# Altium schematic sheet button.SchDoc
size A4
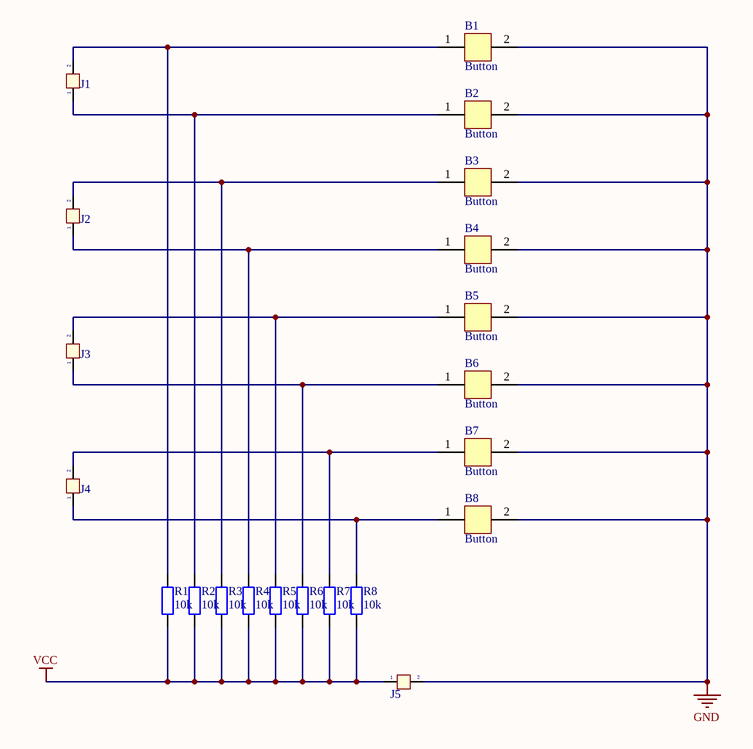
[diagram p0: button.SchDoc]

## Parts
B1  Button  [Button 2 Pin]
B2  Button  [Button 2 Pin]
B3  Button  [Button 2 Pin]
B4  Button  [Button 2 Pin]
B5  Button  [Button 2 Pin]
B6  Button  [Button 2 Pin]
B7  Button  [Button 2 Pin]
B8  Button  [Button 2 Pin]
J1  Jumper 2  [JP2]  (value not drawn)
J2  Jumper 2  [JP2]  (value not drawn)
J3  Jumper 2  [JP2]  (value not drawn)
J4  Jumper 2  [JP2]  (value not drawn)
J5  Jumper 2  [JP2]  (value not drawn)
R1  10k  [R1/4W]
R2  10k  [R1/4W]
R3  10k  [R1/4W]
R4  10k  [R1/4W]
R5  10k  [R1/4W]
R6  10k  [R1/4W]
R7  10k  [R1/4W]
R8  10k  [R1/4W]

## Nets
GND: B1.2 B2.2 B3.2 B4.2 B5.2 B6.2 B7.2 B8.2 J5.2
VCC: J5.1 R1.1 R2.1 R3.1 R4.1 R5.1 R6.1 R7.1 R8.1
NetB1_1: B1.1 J1.2 R1.2
NetB2_1: B2.1 J1.1 R2.2
NetB3_1: B3.1 J2.2 R3.2
NetB4_1: B4.1 J2.1 R4.2
NetB5_1: B5.1 J3.2 R5.2
NetB6_1: B6.1 J3.1 R6.2
NetB7_1: B7.1 J4.2 R7.2
NetB8_1: B8.1 J4.1 R8.2

## Library data of the parts
B1-B8 = Button 2 Pin
J1-J5 = JP 2: Value: JP 2
R1-R8 = R1/4W: Resistor 1/4W; Value: R1/4W - 1K